# Altium schematic sheet SENSE.SchDoc
size C; SheetNumber: 1; SheetTotal: 3
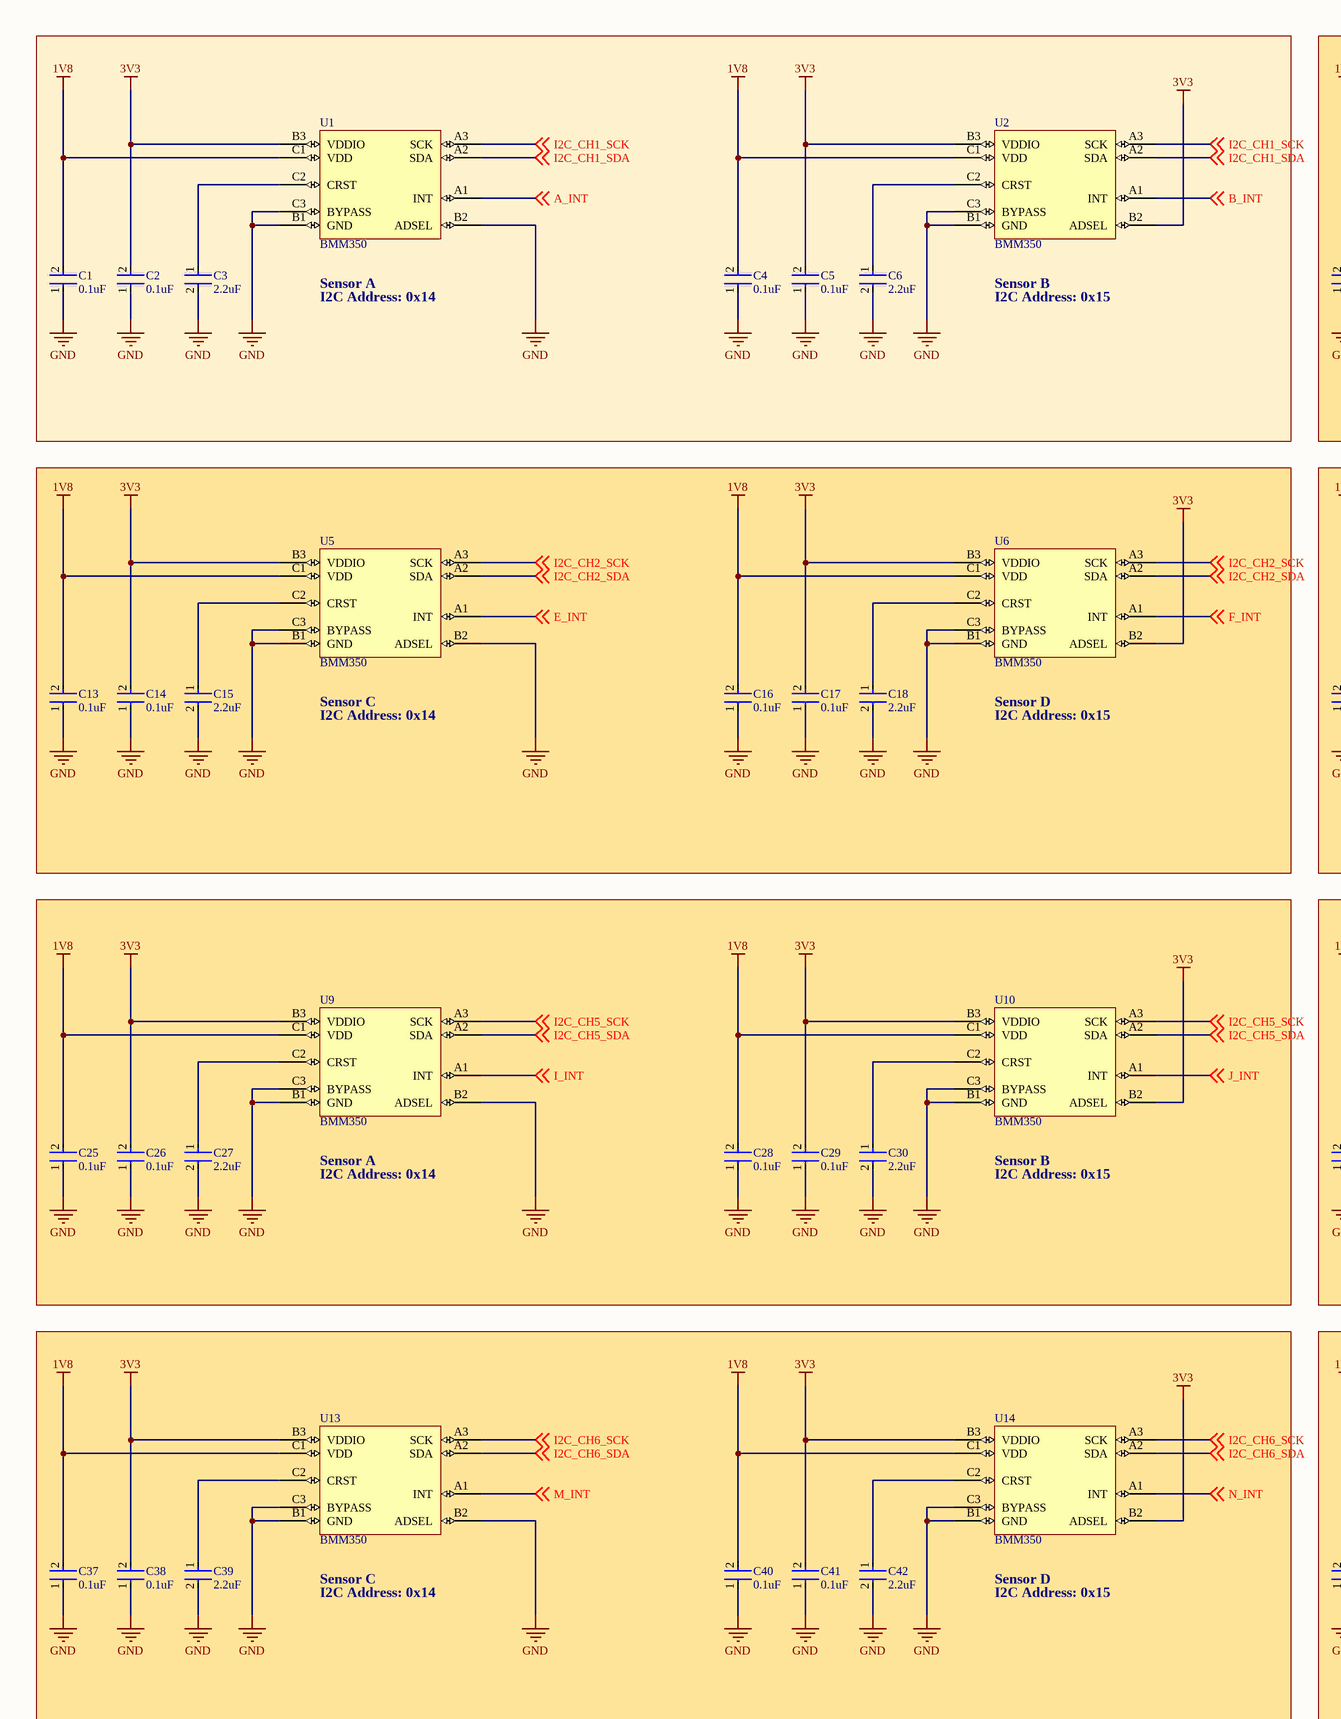
[diagram p0: SENSE.SchDoc, left]
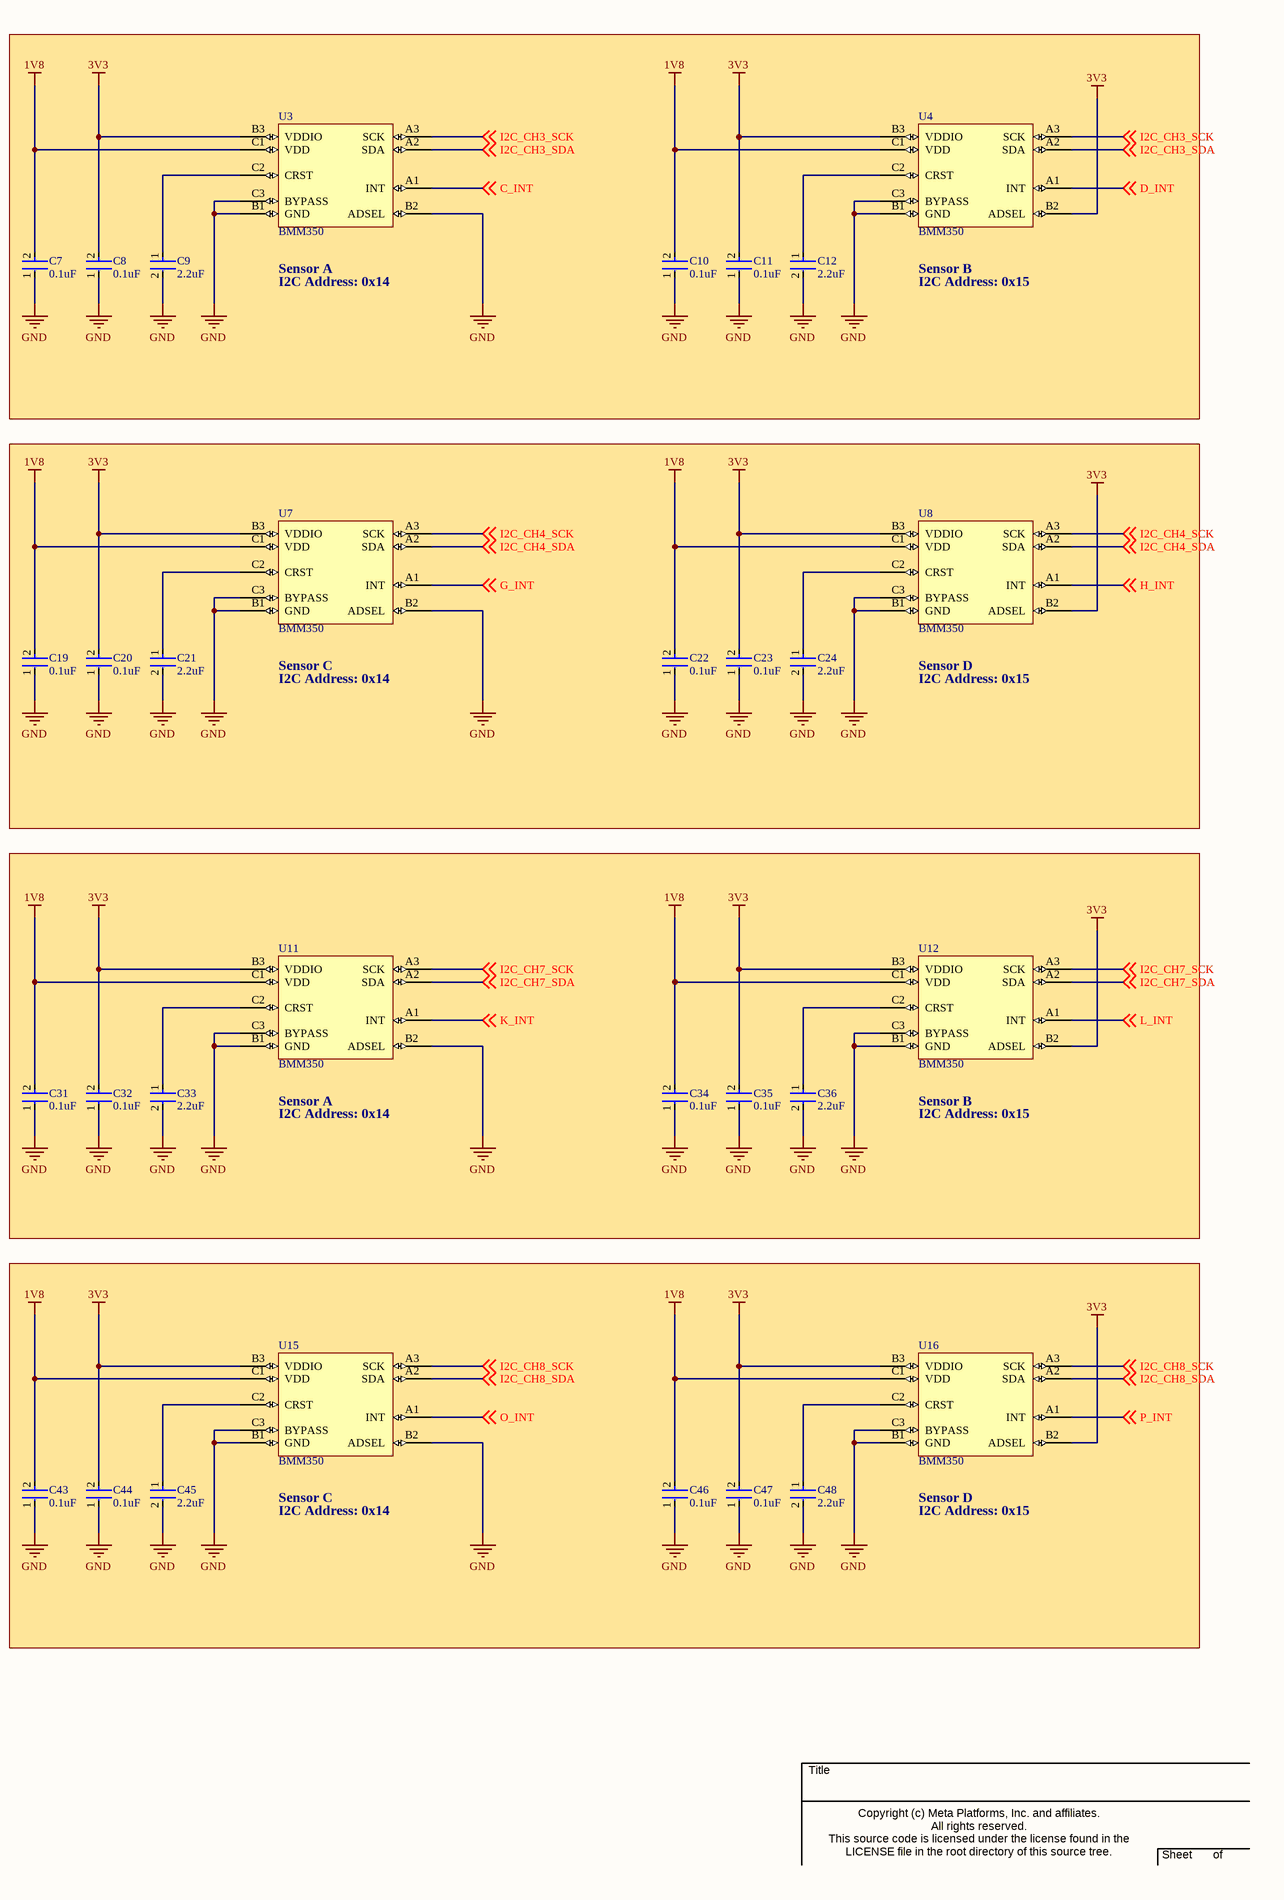
[diagram p1: SENSE.SchDoc, right]

## Parts
C1  0.1uF  [FP-GRM15-MFG]
C2  0.1uF  [FP-GRM15-MFG]
C3  2.2uF  [FP-C1005-050-0_15-0_1-MFG]
C4  0.1uF  [FP-GRM15-MFG]
C5  0.1uF  [FP-GRM15-MFG]
C6  2.2uF  [FP-C1005-050-0_15-0_1-MFG]
C7  0.1uF  [FP-GRM15-MFG]
C8  0.1uF  [FP-GRM15-MFG]
C9  2.2uF  [FP-C1005-050-0_15-0_1-MFG]
C10  0.1uF  [FP-GRM15-MFG]
C11  0.1uF  [FP-GRM15-MFG]
C12  2.2uF  [FP-C1005-050-0_15-0_1-MFG]
C13  0.1uF  [FP-GRM15-MFG]
C14  0.1uF  [FP-GRM15-MFG]
C15  2.2uF  [FP-C1005-050-0_15-0_1-MFG]
C16  0.1uF  [FP-GRM15-MFG]
C17  0.1uF  [FP-GRM15-MFG]
C18  2.2uF  [FP-C1005-050-0_15-0_1-MFG]
C19  0.1uF  [FP-GRM15-MFG]
C20  0.1uF  [FP-GRM15-MFG]
C21  2.2uF  [FP-C1005-050-0_15-0_1-MFG]
C22  0.1uF  [FP-GRM15-MFG]
C23  0.1uF  [FP-GRM15-MFG]
C24  2.2uF  [FP-C1005-050-0_15-0_1-MFG]
C25  0.1uF  [FP-GRM15-MFG]
C26  0.1uF  [FP-GRM15-MFG]
C27  2.2uF  [FP-C1005-050-0_15-0_1-MFG]
C28  0.1uF  [FP-GRM15-MFG]
C29  0.1uF  [FP-GRM15-MFG]
C30  2.2uF  [FP-C1005-050-0_15-0_1-MFG]
C31  0.1uF  [FP-GRM15-MFG]
C32  0.1uF  [FP-GRM15-MFG]
C33  2.2uF  [FP-C1005-050-0_15-0_1-MFG]
C34  0.1uF  [FP-GRM15-MFG]
C35  0.1uF  [FP-GRM15-MFG]
C36  2.2uF  [FP-C1005-050-0_15-0_1-MFG]
C37  0.1uF  [FP-GRM15-MFG]
C38  0.1uF  [FP-GRM15-MFG]
C39  2.2uF  [FP-C1005-050-0_15-0_1-MFG]
C40  0.1uF  [FP-GRM15-MFG]
C41  0.1uF  [FP-GRM15-MFG]
C42  2.2uF  [FP-C1005-050-0_15-0_1-MFG]
C43  0.1uF  [FP-GRM15-MFG]
C44  0.1uF  [FP-GRM15-MFG]
C45  2.2uF  [FP-C1005-050-0_15-0_1-MFG]
C46  0.1uF  [FP-GRM15-MFG]
C47  0.1uF  [FP-GRM15-MFG]
C48  2.2uF  [FP-C1005-050-0_15-0_1-MFG]
U1  BMM350  [BMM350]
U2  BMM350  [BMM350]
U3  BMM350  [BMM350]
U4  BMM350  [BMM350]
U5  BMM350  [BMM350]
U6  BMM350  [BMM350]
U7  BMM350  [BMM350]
U8  BMM350  [BMM350]
U9  BMM350  [BMM350]
U10  BMM350  [BMM350]
U11  BMM350  [BMM350]
U12  BMM350  [BMM350]
U13  BMM350  [BMM350]
U14  BMM350  [BMM350]
U15  BMM350  [BMM350]
U16  BMM350  [BMM350]

## Nets
1V8: C1.2 C4.2 C7.2 C10.2 C13.2 C16.2 C19.2 C22.2 C25.2 C28.2 C31.2 C34.2 C37.2 C40.2 C43.2 C46.2 U1.C1(VDD) U2.C1(VDD) U3.C1(VDD) U4.C1(VDD) U5.C1(VDD) U6.C1(VDD) U7.C1(VDD) U8.C1(VDD) U9.C1(VDD) U10.C1(VDD) U11.C1(VDD) U12.C1(VDD) U13.C1(VDD) U14.C1(VDD) U15.C1(VDD) U16.C1(VDD)
3V3: C2.2 C5.2 C8.2 C11.2 C14.2 C17.2 C20.2 C23.2 C26.2 C29.2 C32.2 C35.2 C38.2 C41.2 C44.2 C47.2 U1.B3(VDDIO) U2.B2(ADSEL) U2.B3(VDDIO) U3.B3(VDDIO) U4.B2(ADSEL) U4.B3(VDDIO) U5.B3(VDDIO) U6.B2(ADSEL) U6.B3(VDDIO) U7.B3(VDDIO) U8.B2(ADSEL) U8.B3(VDDIO) U9.B3(VDDIO) U10.B2(ADSEL) U10.B3(VDDIO) U11.B3(VDDIO) U12.B2(ADSEL) U12.B3(VDDIO) U13.B3(VDDIO) U14.B2(ADSEL) U14.B3(VDDIO) U15.B3(VDDIO) U16.B2(ADSEL) U16.B3(VDDIO)
GND: C1.1 C2.1 C3.2 C4.1 C5.1 C6.2 C7.1 C8.1 C9.2 C10.1 C11.1 C12.2 C13.1 C14.1 C15.2 C16.1 C17.1 C18.2 C19.1 C20.1 C21.2 C22.1 C23.1 C24.2 C25.1 C26.1 C27.2 C28.1 C29.1 C30.2 C31.1 C32.1 C33.2 C34.1 C35.1 C36.2 C37.1 C38.1 C39.2 C40.1 C41.1 C42.2 C43.1 C44.1 C45.2 C46.1 C47.1 C48.2 U1.B1(GND) U1.B2(ADSEL) U1.C3(BYPASS) U2.B1(GND) U2.C3(BYPASS) U3.B1(GND) U3.B2(ADSEL) U3.C3(BYPASS) U4.B1(GND) U4.C3(BYPASS) U5.B1(GND) U5.B2(ADSEL) U5.C3(BYPASS) U6.B1(GND) U6.C3(BYPASS) U7.B1(GND) U7.B2(ADSEL) U7.C3(BYPASS) U8.B1(GND) U8.C3(BYPASS) U9.B1(GND) U9.B2(ADSEL) U9.C3(BYPASS) U10.B1(GND) U10.C3(BYPASS) U11.B1(GND) U11.B2(ADSEL) U11.C3(BYPASS) U12.B1(GND) U12.C3(BYPASS) U13.B1(GND) U13.B2(ADSEL) U13.C3(BYPASS) U14.B1(GND) U14.C3(BYPASS) U15.B1(GND) U15.B2(ADSEL) U15.C3(BYPASS) U16.B1(GND) U16.C3(BYPASS)
A_INT: U1.A1(INT) ; off-sheet A_INT
B_INT: U2.A1(INT) ; off-sheet B_INT
C_INT: U3.A1(INT) ; off-sheet C_INT
D_INT: U4.A1(INT) ; off-sheet D_INT
E_INT: U5.A1(INT) ; off-sheet E_INT
F_INT: U6.A1(INT) ; off-sheet F_INT
G_INT: U7.A1(INT) ; off-sheet G_INT
H_INT: U8.A1(INT) ; off-sheet H_INT
I2C_CH1_SCK: U1.A3(SCK) U2.A3(SCK) ; off-sheet I2C_CH1_SCK
I2C_CH1_SDA: U1.A2(SDA) U2.A2(SDA) ; off-sheet I2C_CH1_SDA
I2C_CH2_SCK: U5.A3(SCK) U6.A3(SCK) ; off-sheet I2C_CH2_SCK
I2C_CH2_SDA: U5.A2(SDA) U6.A2(SDA) ; off-sheet I2C_CH2_SDA
I2C_CH3_SCK: U3.A3(SCK) U4.A3(SCK) ; off-sheet I2C_CH3_SCK
I2C_CH3_SDA: U3.A2(SDA) U4.A2(SDA) ; off-sheet I2C_CH3_SDA
I2C_CH4_SCK: U7.A3(SCK) U8.A3(SCK) ; off-sheet I2C_CH4_SCK
I2C_CH4_SDA: U7.A2(SDA) U8.A2(SDA) ; off-sheet I2C_CH4_SDA
I2C_CH5_SCK: U9.A3(SCK) U10.A3(SCK) ; off-sheet I2C_CH5_SCK
I2C_CH5_SDA: U9.A2(SDA) U10.A2(SDA) ; off-sheet I2C_CH5_SDA
I2C_CH6_SCK: U13.A3(SCK) U14.A3(SCK) ; off-sheet I2C_CH6_SCK
I2C_CH6_SDA: U13.A2(SDA) U14.A2(SDA) ; off-sheet I2C_CH6_SDA
I2C_CH7_SCK: U11.A3(SCK) U12.A3(SCK) ; off-sheet I2C_CH7_SCK
I2C_CH7_SDA: U11.A2(SDA) U12.A2(SDA) ; off-sheet I2C_CH7_SDA
I2C_CH8_SCK: U15.A3(SCK) U16.A3(SCK) ; off-sheet I2C_CH8_SCK
I2C_CH8_SDA: U15.A2(SDA) U16.A2(SDA) ; off-sheet I2C_CH8_SDA
I_INT: U9.A1(INT) ; off-sheet I_INT
J_INT: U10.A1(INT) ; off-sheet J_INT
K_INT: U11.A1(INT) ; off-sheet K_INT
L_INT: U12.A1(INT) ; off-sheet L_INT
M_INT: U13.A1(INT) ; off-sheet M_INT
N_INT: U14.A1(INT) ; off-sheet N_INT
O_INT: U15.A1(INT) ; off-sheet O_INT
P_INT: U16.A1(INT) ; off-sheet P_INT
NetC3_1: C3.1 U1.C2(CRST)
NetC6_1: C6.1 U2.C2(CRST)
NetC9_1: C9.1 U3.C2(CRST)
NetC12_1: C12.1 U4.C2(CRST)
NetC15_1: C15.1 U5.C2(CRST)
NetC18_1: C18.1 U6.C2(CRST)
NetC21_1: C21.1 U7.C2(CRST)
NetC24_1: C24.1 U8.C2(CRST)
NetC27_1: C27.1 U9.C2(CRST)
NetC30_1: C30.1 U10.C2(CRST)
NetC33_1: C33.1 U11.C2(CRST)
NetC36_1: C36.1 U12.C2(CRST)
NetC39_1: C39.1 U13.C2(CRST)
NetC42_1: C42.1 U14.C2(CRST)
NetC45_1: C45.1 U15.C2(CRST)
NetC48_1: C48.1 U16.C2(CRST)

## Notes on the sheet
- I2C Address: 0x14
- (near U1) Sensor A
- I2C Address: 0x15
- (near U2) Sensor B
- (near U3) Sensor A
- (near U4) Sensor B
- (near U5) Sensor C
- (near U6) Sensor D
- (near U7) Sensor C
- (near U8) Sensor D
- (near U9) Sensor A
- (near U10) Sensor B
- (near U11) Sensor A
- (near U12) Sensor B
- (near U13) Sensor C
- (near U14) Sensor D
- (near U15) Sensor C
- (near U16) Sensor D
- Title
- Copyright (c) Meta Platforms, Inc. and affiliates.
  All rights reserved.
  This source code is licensed under the license found in the
  LICENSE file in the root directory of this source tree.
- Sheet
- of

## Library data of the parts
C1 C2 C4 C5 C7 C8 C10 C11 C13 C14 C16 C17 C19 C20 C22 C23 C25 C26 C28 C29 C31 C32 C34 C35 C37 C38 C40 C41 C43 C44 C46 C47 = CMP-2100-03641-2: CAP CER 0.1UF 16V X7R 0402; Manufacturer Part Number: GRM155R71C104KA88D; Manufacturer: Murata; Standoff Height: 0mm; Tolerance: 10%; Voltage Rating: 16Vdc; Material: Ceramic; Capacitance: 0.10μF; Value: 0.10μF; RoHS: TRUE; Temperature Characteristic: X7R; Octopart: https://octopart.com/grm155r71c104ka88d-murata-196880; Digikey Description: CAP CER 0.1UF 16V X7R 0402; Device Class L3: Ceramic Capacitors; Height: 0.55mm; ComponentLink2Description: Datasheet; Temperature Range Low: -55°C; Ipc Land Pattern Name: CAPC10050X219; ComponentLink2URL: https://search.murata.co.jp/Ceramy/image/img/A01X/G101/ENG/GRM155R71H471KA01-01A.pdf; Device Class L1: Passive Components; Lead Free: yes; Category: Cap; Package: GRM15; Temperature: -55°C to +125°C; Device Class L2: Capacitors; Temperature Range High: +125°C; Mouser Description: 0402 0.1 uF 16V ±10 % Tolerance X7R SMT Multilayer Ceramic Capacitor
C3 C6 C9 C12 C15 C18 C21 C24 C27 C30 C33 C36 C39 C42 C45 C48 = CMP-08246-004344-1: CAP CER 2.2UF 10V X7S 0402; Dielectric Material: Ceramic; Tolerance: 10%; Mount: Surface Mount; Height: 0.5mm; Package Quantity: 1; Depth: 0.5mm; RoHS Compliant: Yes; Length: 1mm; Thickness: 0.022inch; Packaging: Tape and Reel; Capacitance: 2.2uF; Case Code (Imperial): 0402; Resistor Type: Ceramic; Dielectric: X7S; Case/Package: 0402; Min Operating Temperature: -55°C; Voltage Rating: 10V; Series: C; Weight: 2.3E-05oz; Width: 0.02inch; Voltage Rating (DC): 10V; Case Code (Metric): 1005; Max Operating Temperature: 125°C; Termination: SMD/SMT; Lead Free: Lead Free